# Altium schematic sheet S7CAS-PLEIADES-CARTE-MERE_P07_ASIC.SchDoc
size Tabloid; DocumentNumber: 3; SheetNumber: 3; SheetTotal: 3; Sheet_Name: ASIC; Size: 11x17
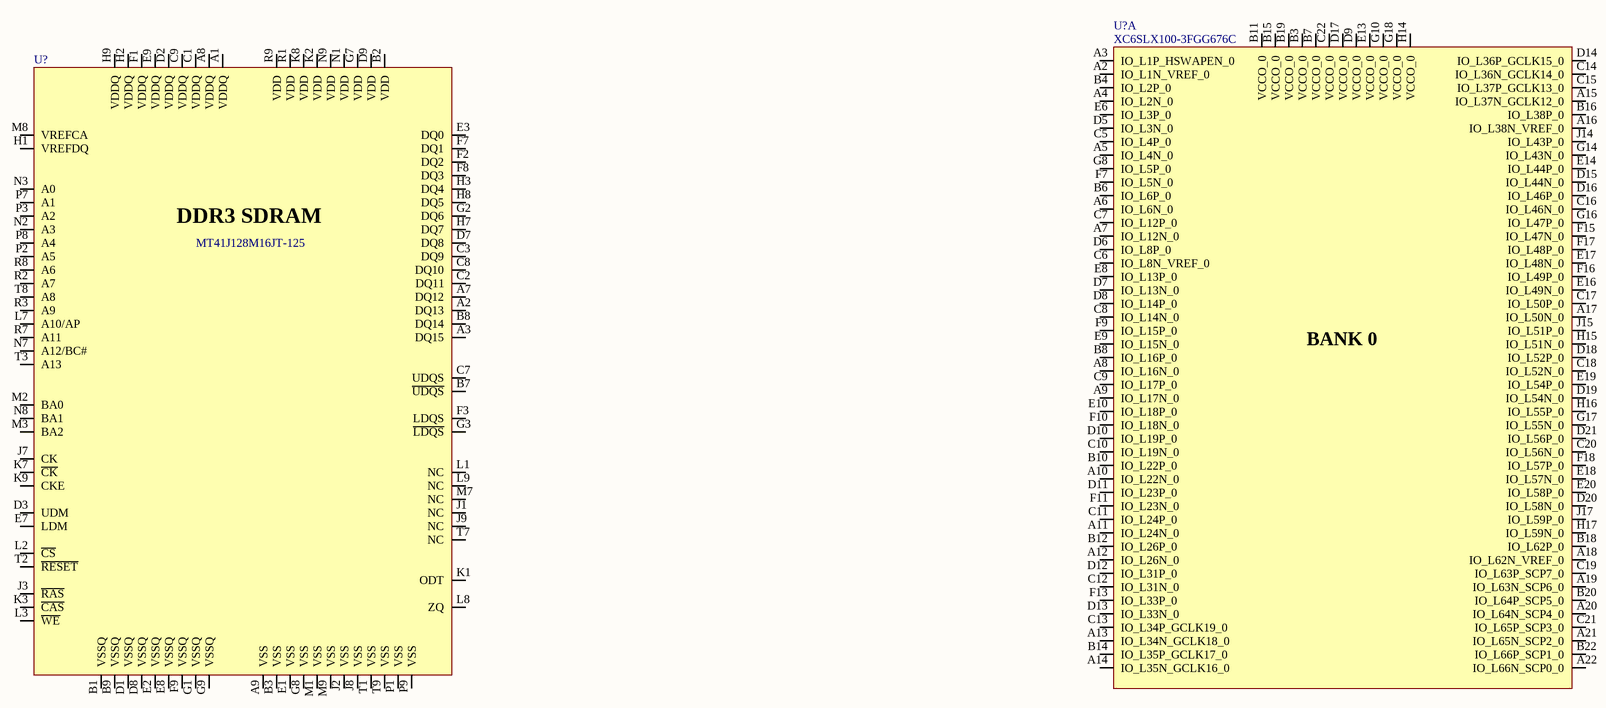
[diagram p0: S7CAS-PLEIADES-CARTE-MERE_P07_ASIC.SchDoc]

## Parts
(Parts that share a designator on the sheet are numbered #1, #2 ... from top to bottom, then left to right.)
U?#1  XC6SLX100-3FGG676C  [FPGA_XILINX_FGG676]  (part A of 10)
U?#2  MT41J128M16JT-125  [MEM_DDR3_MT41J128M16JT-125]

## Nets

Not connected (* = marked no-connect by the designer): U?#1 A2(IO_L1N_VREF_0) A3(IO_L1P_HSWAPEN_0) A4(IO_L2N_0) A5(IO_L4N_0) A6(IO_L6N_0) A7(IO_L12N_0) A8(IO_L16N_0) A9(IO_L17N_0) A10(IO_L22N_0) A11(IO_L24N_0) A12(IO_L26N_0) A13(IO_L34N_GCLK18_0) A14(IO_L35N_GCLK16_0) A15(IO_L37N_GCLK12_0) A16(IO_L38N_VREF_0) A17(IO_L50N_0) A18(IO_L62N_VREF_0) A19(IO_L63N_SCP6_0) A20(IO_L64N_SCP4_0) A21(IO_L65N_SCP2_0) A22(IO_L66N_SCP0_0) B3(VCCO_0) B4(IO_L2P_0) B6(IO_L6P_0) B7(VCCO_0) B8(IO_L16P_0) B10(IO_L22P_0) B11(VCCO_0) B12(IO_L26P_0) B14(IO_L35P_GCLK17_0) B15(VCCO_0) B16(IO_L38P_0) B18(IO_L62P_0) B19(VCCO_0) B20(IO_L64P_SCP5_0) B22(IO_L66P_SCP1_0) C5(IO_L4P_0) C6(IO_L8N_VREF_0) C7(IO_L12P_0) C8(IO_L14N_0) C9(IO_L17P_0) C10(IO_L19N_0) C11(IO_L24P_0) C12(IO_L31N_0) C13(IO_L34P_GCLK19_0) C14(IO_L36N_GCLK14_0) C15(IO_L37P_GCLK13_0) C16(IO_L46N_0) C17(IO_L50P_0) C18(IO_L52N_0) C19(IO_L63P_SCP7_0) C20(IO_L56N_0) C21(IO_L65P_SCP3_0) C22(VCCO_0) D5(IO_L3N_0) D6(IO_L8P_0) D7(IO_L13N_0) D8(IO_L14P_0) D9(VCCO_0) D10(IO_L19P_0) D11(IO_L23P_0) D12(IO_L31P_0) D13(IO_L33N_0) D14(IO_L36P_GCLK15_0) D15(IO_L44N_0) D16(IO_L46P_0) D17(VCCO_0) D18(IO_L52P_0) D19(IO_L54N_0) D20(IO_L58N_0) D21(IO_L56P_0) E6(IO_L3P_0) E8(IO_L13P_0) E9(IO_L15N_0) E10(IO_L18P_0) E13(VCCO_0) E14(IO_L44P_0) E16(IO_L49N_0) E17(IO_L48N_0) E18(IO_L57N_0) E19(IO_L54P_0) E20(IO_L58P_0) F7(IO_L5N_0) F9(IO_L15P_0) F10(IO_L18N_0) F11(IO_L23N_0) F13(IO_L33P_0) F15(IO_L47N_0) F16(IO_L49P_0) F17(IO_L48P_0) F18(IO_L57P_0) G8(IO_L5P_0) G10(VCCO_0) G14(IO_L43N_0) G16(IO_L47P_0) G17(IO_L55N_0) G18(VCCO_0) H14(VCCO_0) H15(IO_L51N_0) H16(IO_L55P_0) H17(IO_L59N_0) J14(IO_L43P_0) J15(IO_L51P_0) J17(IO_L59P_0); U?#2 A1(VDDQ) A2(DQ13) A3(DQ15) A7(DQ12) A8(VDDQ) A9(VSS) B1(VSSQ) B2(VDD) B3(VSS) B7(~{UDQS}) B8(DQ14) B9(VSSQ) C1(VDDQ) C2(DQ11) C3(DQ9) C7(UDQS) C8(DQ10) C9(VDDQ) D1(VSSQ) D2(VDDQ) D3(UDM) D7(DQ8) D8(VSSQ) D9(VDD) E1(VSS) E2(VSSQ) E3(DQ0) E7(LDM) E8(VSSQ) E9(VDDQ) F1(VDDQ) F2(DQ2) F3(LDQS) F7(DQ1) F8(DQ3) F9(VSSQ) G1(VSSQ) G2(DQ6) G3(~{LDQS}) G7(VDD) G8(VSS) G9(VSSQ) H1(VREFDQ) H2(VDDQ) H3(DQ4) H7(DQ7) H8(DQ5) H9(VDDQ) J1(NC) J2(VSS) J3(~{RAS}) J7(CK) J8(VSS) J9(NC) K1(ODT) K2(VDD) K3(~{CAS}) K7(~{CK}) K8(VDD) K9(CKE) L1(NC) L2(~{CS}) L3(~{WE}) L7(A10/AP) L8(ZQ) L9(NC) M1(VSS) M2(BA0) M3(BA2) M7(NC) M8(VREFCA) M9(VSS) N1(VDD) N2(A3) N3(A0) N7(A12/BC#) N8(BA1) N9(VDD) P1(VSS) P2(A5) P3(A2) P7(A1) P8(A4) P9(VSS) R1(VDD) R2(A7) R3(A9) R7(A11) R8(A6) R9(VDD) T1(VSS) T2(~{RESET}) T3(A13) T7(NC) T8(A8) T9(VSS)

## Notes on the sheet
- Sheet Name
- Project Title
- Global Project
- Size
- Group
- Revision
- Date
- Sheet
- of
- Filename
- Designers
- (in symbol FPGA_XC6SLX100-3FGG676C, part A) BANK 0
- (in symbol MEM_DDR3_MT41J128M16JT-125:K TR) DDR3 SDRAM

## Library data of the parts
U?#1 = FPGA_XC6SLX100-3FGG676C: FPGA - XILINX SPARTAN 6 480 I/O - BGA-676; Voltage: 1.14 V ~ 1.26 V; Current: *; Power: *; Mfg: Xilinx; Mfg Part Number: XC6SLX100-3FGG676C; HelpURL: https://www.xilinx.com/support/documentation/data_sheets/ds162.pdf; CreatedBy: Jonathan Bouchard; Temperature: 0°C ~ 85°C (TJ); Value: *; Precision: *; Package: BGA-676; Supplier 1: Digikey; Supplier Part Number 1: 122-1760-ND
U?#2 = MEM_DDR3_MT41J128M16JT-125:K TR: MEM - DDR3 SDRAM 2GBIT 800MHZ - TFBGA-96; Voltage: 1.425 V ~ 1.575 V; Mfg: Micrel; Current: *; Power: *; Mfg Part Number: http://www.micron.com/~/media/Documents/Products/Data%20Sheet/DRAM/DDR3/2Gb_DDR3_SDRAM.pdf; HelpURL: http://ww1.microchip.com/downloads/en/DeviceDoc/00002275A.pdf; CreatedBy: Jonathan Bouchard; Temperature: 0°C ~ 95°C (TC); Value: *; Precision: *; Package: TFBGA-96; Supplier 1: Digikey; Supplier Part Number 1: 557-1611-1-ND